# EAGLE design ADA4075 (EAGLE 7.4.0)
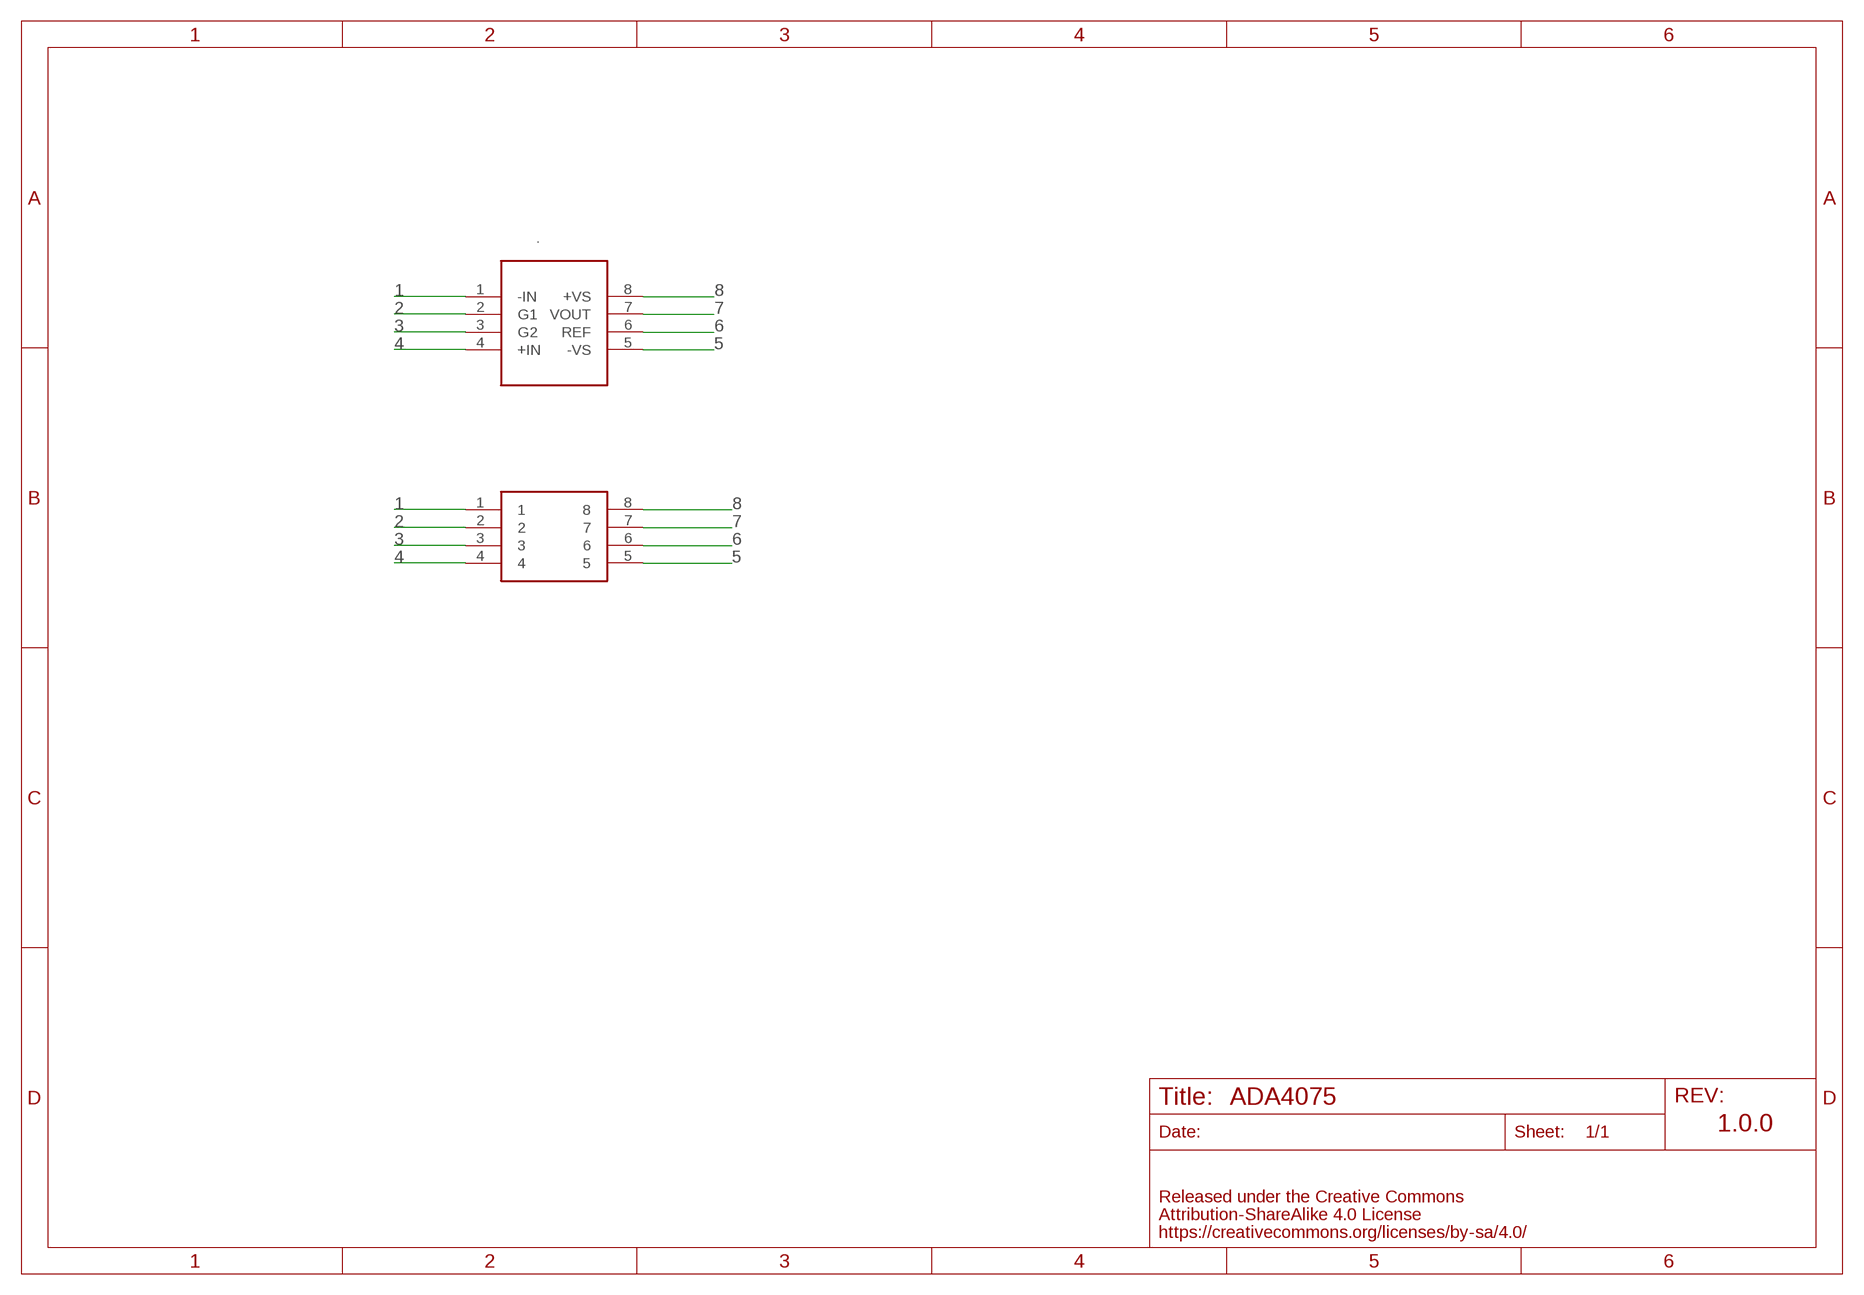
[diagram p0: schematic, sheet 1]

## Parts
.  ADA4075  [SOIC(NARROW)-8]
U$3  8PIN  [8PIN]

## Nets
1: ..1(-IN) U$3.1
2: ..2(G1) U$3.2
3: ..3(G2) U$3.3
4: ..4(+IN) U$3.4
5: ..5(-VS) U$3.5
6: ..6(REF) U$3.6
7: ..7(VOUT) U$3.7
8: ..8(+VS) U$3.8

## Notes on the sheet
- 1.0.0

## Library data of the parts
. = FaBo-Opamp:ADA4075
U$3 = FaBo-Breakout:8PIN

## Board
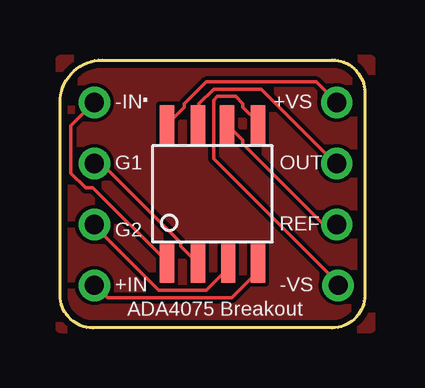
[diagram p1: board, top side]
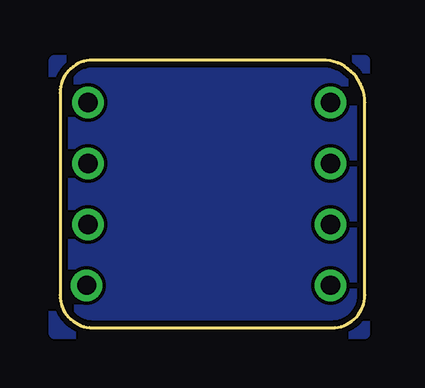
[diagram p2: board, bottom side, seen from below]

Size 12.7 x 11.16 mm. Coordinates in mm from the lower left corner, seen from the top.
Copper layers (1*16): Top 0.035mm / dielectric 1.5mm / Bottom 0.035mm
Design rules "Elecrow_2-layer_eagle_rule": minimum track width 6mil, minimum drill 12mil, track to track 6mil, track to pad 6mil, pad to pad 6mil, via to via 6mil, smd to smd 0mil, copper to edge 10mil, drill to drill 10mil, minimum pad ring 10mil, minimum via ring 6mil, stop-mask expansion 2mil, vias tented up to drill 100mil, thermal gap 10mil

### Footprints (pad centres in the part's own frame; a part is rotated, then mirrored left to right if it is on the bottom)
SOIC(NARROW)-8 = smd 0.6 x 1.6: 1 -1.9,-2.9; 2 -0.6,-2.9; 3 0.66,-2.9; 4 1.9,-2.9; 5 1.9,2.9; 6 0.6,2.9; 7 -0.6,2.9; 8 -1.9,2.9
8PIN = drill 0.8: 1 -4.92,3.81; 2 -4.92,1.27; 3 -4.92,-1.27; 4 -4.92,-3.81; 5 5.24,-3.81; 6 5.18,-1.27; 7 5.18,1.27; 8 5.18,3.81

### Placement (x,y rotation side)
.  6.35,5.58 0 top
U$3  6.35,5.58 0 top

### Tracks (layer width: path | path; a pad name or v marks a point on that pad's centre or on a via)
1
  Top 0.152: ..1 4.42,2.79 1.37,5.83 1.07,5.83 0.46,6.44 0.46,8.43 1.37,9.34 U$3.1
2
  Top 0.152: ..2 5.64,2.79 5.03,3.4 5.03,3.55 1.83,6.75 1.52,6.75 U$3.2
3
  Top 0.152: ..3 6.86,2.63 6.86,2.33 6.1,1.57 4.12,1.57 1.37,4.31 U$3.3
4
  Top 0.152: ..4 8.23,2.63 8.23,2.33 7.16,1.26 1.98,1.26 1.52,1.72 U$3.4
5
  Top 0.152: ..5 8.23,8.58 7.62,9.19 7.62,9.34 7.32,9.64 6.55,9.64 6.4,9.49 6.4,7.05 11.58,1.87 U$3.5
6
  Top 0.152: U$3.6 10.97,4.31 7.62,7.66 7.62,7.82 7.01,8.43 ..6
7
  Top 0.152: ..7 5.79,8.58 5.79,9.34 6.4,9.95 8.38,9.95 11.43,6.9 U$3.7
8
  Top 0.152: ..8 4.57,8.58 5.18,9.19 5.18,9.34 6.1,10.25 10.67,10.25 11.43,9.49 U$3.8
GND
  pour Top: 0,-0.01 12.95,-0.01 12.95,11.17 0,11.17 0,0.25
  pour Bottom: 0,-0.26 12.95,-0.26 12.95,11.17 0,11.17

### Text on the board
tPlace: -IN | +VS | G1 | OUT | G2 | REF | +IN | -VS | ADA4075 Breakout